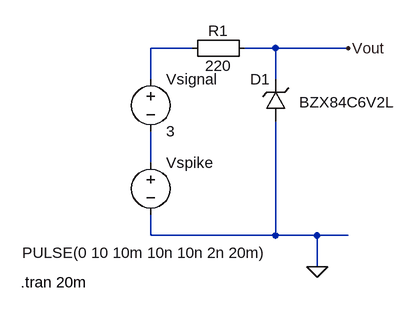
[diagram p0: schematic ZenerClamp.asc]
ZenerClamp.asc, the LTspice schematic file:
Version 4
SHEET 1 880 680
WIRE 176 96 112 96
WIRE 304 96 256 96
WIRE 416 96 304 96
WIRE 112 144 112 96
WIRE 304 144 304 96
WIRE 112 272 112 224
WIRE 112 384 112 352
WIRE 304 384 304 208
WIRE 304 384 112 384
WIRE 368 384 304 384
WIRE 416 384 368 384
WIRE 368 432 368 384
FLAG 368 432 0
FLAG 416 96 Vout
SYMBOL voltage 112 128 R0
WINDOW 123 0 0 Left 0
WINDOW 39 0 0 Left 0
SYMATTR InstName Vsignal
SYMATTR Value 3
SYMBOL zener 320 208 R180
WINDOW 0 24 64 Left 2
WINDOW 3 -167 29 Left 2
SYMATTR InstName D1
SYMATTR Value BZX84C6V2L
SYMBOL Misc\\EuropeanResistor 272 80 R90
WINDOW 0 5 56 VBottom 2
WINDOW 3 27 56 VTop 2
SYMATTR InstName R1
SYMATTR Value 220
SYMBOL voltage 112 256 R0
WINDOW 3 -198 155 Left 2
WINDOW 123 0 0 Left 0
WINDOW 39 0 0 Left 0
SYMATTR InstName Vspike
SYMATTR Value PULSE(0 10 10m 10n 10n 2n 20m)
TEXT -88 456 Left 2 !.tran 20m

The netlist it stands for:
* ZenerClamp.asc
Vsignal N001 N002 3
D1 0 Vout BZX84C6V2L
R1 Vout N001 220
Vspike N002 0 PULSE(0 10 10m 10n 10n 2n 20m)
.model D D
.lib standard.dio
.tran 20m
.backanno
.end